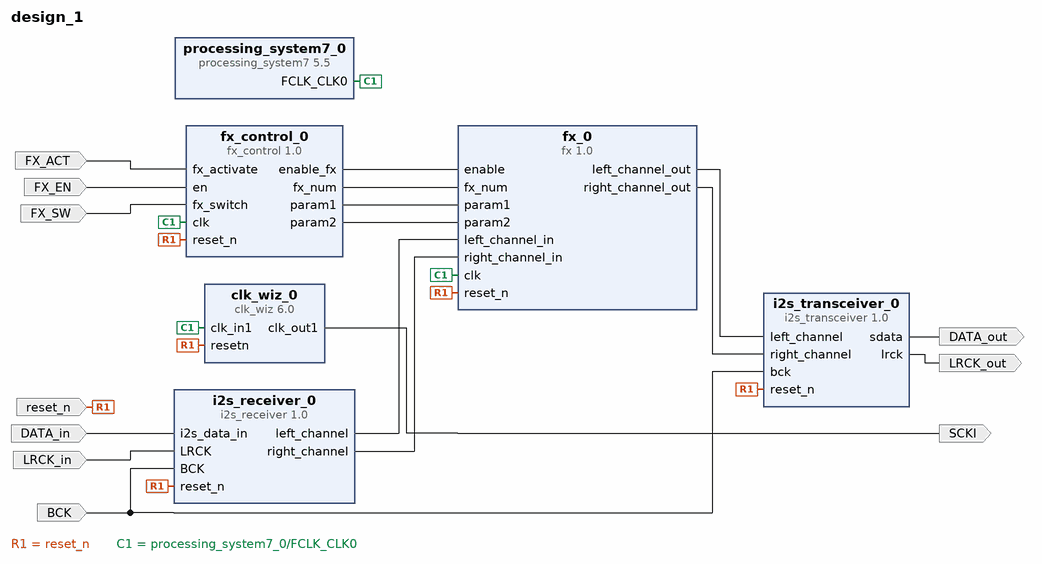
[diagram p0: block diagram of the top level]
# Vivado block design design_1, xc7z010clg400-1, Vivado 2021.1
create_bd_design design_1

create_bd_port -dir O DATA_out
create_bd_port -dir O LRCK_out
create_bd_port -dir O -type clk SCKI
create_bd_port -dir I -type rst reset_n
create_bd_port -dir I DATA_in
create_bd_port -dir I -type clk BCK
set_property -dict {CONFIG.FREQ_HZ 5000000} [get_bd_ports BCK]
create_bd_port -dir I LRCK_in
create_bd_port -dir I FX_EN
create_bd_port -dir I FX_SW
create_bd_port -dir I FX_ACT

create_bd_cell -type ip -vlnv xilinx.com:user:i2s_receiver:1.0 i2s_receiver_0
create_bd_cell -type ip -vlnv xilinx.com:user:i2s_transceiver:1.0 i2s_transceiver_0
create_bd_cell -type ip -vlnv xilinx.com:ip:clk_wiz:6.0 clk_wiz_0
set_property -dict [list \
  CONFIG.CLKOUT1_JITTER 222.915 \
  CONFIG.CLKOUT1_PHASE_ERROR 157.402 \
  CONFIG.CLKOUT1_REQUESTED_OUT_FREQ 30.000 \
  CONFIG.MMCM_CLKFBOUT_MULT_F 19.875 \
  CONFIG.MMCM_CLKOUT0_DIVIDE_F 33.125 \
  CONFIG.MMCM_DIVCLK_DIVIDE 1 \
  CONFIG.RESET_PORT resetn \
  CONFIG.RESET_TYPE ACTIVE_LOW \
] [get_bd_cells clk_wiz_0]
create_bd_cell -type ip -vlnv xilinx.com:ip:processing_system7:5.5 processing_system7_0
set_property -dict {CONFIG.PCW_USE_M_AXI_GP0 0} [get_bd_cells processing_system7_0]
# 1 more settings of processing_system7_0 are not shown: defaults, MIO pin electricals, DDR timing, and values the tool derives
create_bd_cell -type ip -vlnv xilinx.com:user:fx:1.0 fx_0
create_bd_cell -type ip -vlnv xilinx.com:user:fx_control:1.0 fx_control_0

# ---- connections ----

connect_bd_net [get_bd_ports BCK] [get_bd_pins i2s_transceiver_0/bck] [get_bd_pins i2s_receiver_0/BCK]
connect_bd_net [get_bd_ports DATA_in] [get_bd_pins i2s_receiver_0/i2s_data_in]
connect_bd_net [get_bd_ports FX_ACT] [get_bd_pins fx_control_0/fx_activate]
connect_bd_net [get_bd_ports FX_EN] [get_bd_pins fx_control_0/en]
connect_bd_net [get_bd_ports FX_SW] [get_bd_pins fx_control_0/fx_switch]
connect_bd_net [get_bd_ports LRCK_in] [get_bd_pins i2s_receiver_0/LRCK]
connect_bd_net [get_bd_ports reset_n] \
  [get_bd_pins i2s_transceiver_0/reset_n] [get_bd_pins i2s_receiver_0/reset_n] [get_bd_pins clk_wiz_0/resetn] \
  [get_bd_pins fx_0/reset_n] [get_bd_pins fx_control_0/reset_n]
connect_bd_net [get_bd_pins clk_wiz_0/clk_out1] [get_bd_ports SCKI]
connect_bd_net [get_bd_pins fx_0/left_channel_out] [get_bd_pins i2s_transceiver_0/left_channel]
connect_bd_net [get_bd_pins fx_0/right_channel_out] [get_bd_pins i2s_transceiver_0/right_channel]
connect_bd_net [get_bd_pins fx_control_0/enable_fx] [get_bd_pins fx_0/enable]
connect_bd_net [get_bd_pins fx_control_0/fx_num] [get_bd_pins fx_0/fx_num]
connect_bd_net [get_bd_pins fx_control_0/param1] [get_bd_pins fx_0/param1]
connect_bd_net [get_bd_pins fx_control_0/param2] [get_bd_pins fx_0/param2]
connect_bd_net [get_bd_pins i2s_receiver_0/left_channel] [get_bd_pins fx_0/left_channel_in]
connect_bd_net [get_bd_pins i2s_receiver_0/right_channel] [get_bd_pins fx_0/right_channel_in]
connect_bd_net [get_bd_pins i2s_transceiver_0/lrck] [get_bd_ports LRCK_out]
connect_bd_net [get_bd_pins i2s_transceiver_0/sdata] [get_bd_ports DATA_out]
connect_bd_net [get_bd_pins processing_system7_0/FCLK_CLK0] [get_bd_pins clk_wiz_0/clk_in1] [get_bd_pins fx_0/clk] [get_bd_pins fx_control_0/clk]

validate_bd_design
save_bd_design
